# EAGLE schematic Distorsionador (EAGLE 7.2.0)
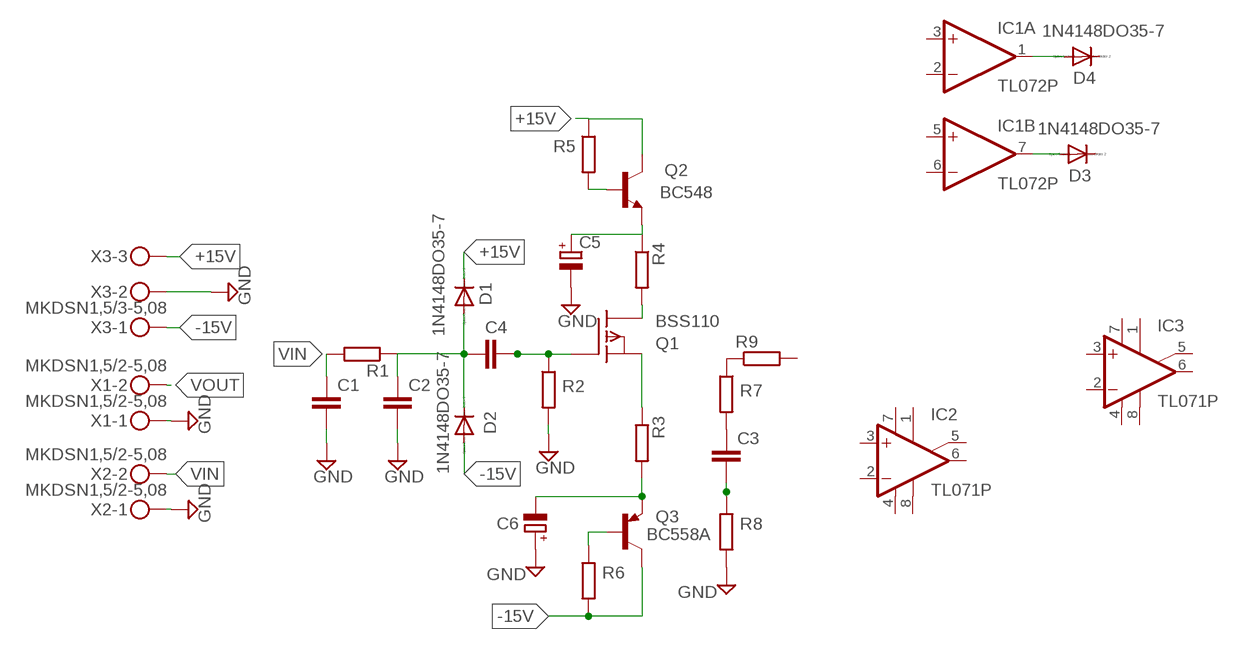
[diagram p0: schematic, sheet 1]

## Parts
C1  C-EU025-025X050  [C025-025X050]
C2  C-EU025-025X050  [C025-025X050]
C3  C-EU025-025X050  [C025-025X050]
C4  C-EU025-025X050  [C025-025X050]
C5  CPOL-EUE2.5-5  [E2,5-5]
C6  CPOL-EUE2.5-5  [E2,5-5]
D1  1N4148DO35-7  [DO35-7]
D2  1N4148DO35-7  [DO35-7]
D3  1N4148DO35-7  [DO35-7]
D4  1N4148DO35-7  [DO35-7]
IC1  TL072P  [DIL08]
IC2  TL071P  [DIL08]
IC3  TL071P  [DIL08]
Q1  BSS110  [TO92]
Q2  BC548  [TO92-EBC]
Q3  BC558A  [TO92-EBC]
R1  R-EU_0207/7  [0207/7]
R2  R-EU_0207/7  [0207/7]
R3  R-EU_0207/7  [0207/7]
R4  R-EU_0207/7  [0207/7]
R5  R-EU_0207/7  [0207/7]
R6  R-EU_0207/7  [0207/7]
R7  R-EU_0207/7  [0207/7]
R8  R-EU_0207/7  [0207/7]
R9  R-EU_0207/7  [0207/7]
X1  MKDSN1,5/2-5,08  [MKDSN1,5/2-5,08]
X2  MKDSN1,5/2-5,08  [MKDSN1,5/2-5,08]
X3  MKDSN1,5/3-5,08  [MKDSN1,5/3-5,08]

## Nets
+15V: D1.C Q2.C R5.1 X3.3
-15V: D2.A Q3.C R6.2 X3.1
GND: C1.2 C2.2 C5.- C6.+ R2.2 R8.2 X1.1 X2.1 X3.2
N$1: C4.2 Q1.2(G) R2.1
N$2: C5.+ Q2.E R4.1
N$3: Q2.B R5.2
N$4: C6.- Q3.E R3.2
N$5: R7.1 R9.1
N$6: Q3.B R6.1
N$8: C3.1 R7.2
N$9: Q1.1(S) R3.1
N$10: Q1.3(D) R4.2
N$12: C2.1 C4.1 D1.A D2.C R1.1
N$13: C3.2 R8.1
N$14: D3.A IC1.7(B:OUT)
N$15: D4.A IC1.1(A:OUT)
VIN: C1.1 R1.2 X2.2
VOUT: X1.2
Unconnected: D3.C D4.C IC1.2(A:-IN) IC1.3(A:+IN) IC1.5(B:+IN) IC1.6(B:-IN) IC2.1(ON1) IC2.2(-IN) IC2.3(+IN) IC2.5(ON2) IC2.6(OUT) IC2.8(OPT) IC3.1(ON1) IC3.2(-IN) IC3.3(+IN) IC3.5(ON2) IC3.6(OUT) IC3.8(OPT) R9.2

## Power pins joined to a net without a drawn wire
V+: IC1.8(P:V+) IC2.7(V+) IC3.7(V+)
V-: IC1.4(P:V-) IC2.4(V-) IC3.4(V-)

## Library data of the parts
C1-C4 = rcl:C-EU: CAPACITOR, European symbol
C5 C6 = rcl:CPOL-EU: POLARIZED CAPACITOR, European symbol
D1-D4 = diode:1N4148: DIODE high speed (Philips)
IC1 = linear:TL072: OP AMP
IC2 IC3 = linear:TL071: OP AMP
Q1 = transistor-fet:BSS110: P-Channel Enhancement MOSFET -50V; -0,17A; 6Ohm
Q2 = transistor-npn:BC548*: NPN Transistor
Q3 = transistor-pnp:BC558*: PNP Transistror
R1-R9 = rcl:R-EU_: RESISTOR, European symbol
X1 X2 = con-phoenix-508:MKDSN1,5/2-5,08: MKDSN 1,5/ 2-5,08 Printklemme Nennstrom: 13,5 A Nennspannung: 250 V Rastermaß: 5,08 mm Polzahl: 2 Anschlussart: Schraubanschluss Montage: Löten Anschlussrichtung Leiter/Platine: 0 ° Artikelnummer: 1729128 Source: http://eshop.phoenixcontact.com .. 1729128.pdf
X3 = con-phoenix-508:MKDSN1,5/3-5,08: MKDSN 1,5/ 3-5,08 Printklemme Nennstrom: 13,5 A Nennspannung: 250 V Rastermaß: 5,08 mm Polzahl: 3 Anschlussart: Schraubanschluss Montage: Löten Anschlussrichtung Leiter/Platine: 0 ° Artikelnummer: 1729131 Source: http://eshop.phoenixcontact.com .. 1729131.pdf